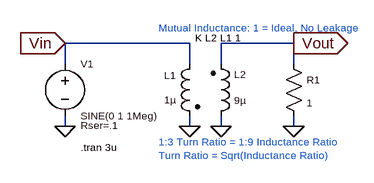
[diagram p0: schematic Transformer-2coil.asc]
Transformer-2coil.asc, the LTspice schematic file:
Version 4
SHEET 1 880 680
WIRE 256 96 64 96
WIRE 416 96 304 96
WIRE 64 128 64 96
WIRE 256 128 256 96
WIRE 304 128 304 96
WIRE 416 128 416 96
WIRE 64 224 64 208
WIRE 256 224 256 208
WIRE 304 224 304 208
WIRE 416 224 416 208
FLAG 64 224 0
FLAG 256 224 0
FLAG 304 224 0
FLAG 416 224 0
FLAG 416 96 Vout
IOPIN 416 96 Out
FLAG 64 96 Vin
IOPIN 64 96 In
SYMBOL voltage 64 112 R0
WINDOW 123 0 0 Left 0
WINDOW 39 24 110 Left 1
WINDOW 0 24 16 Left 1
WINDOW 3 24 96 Left 1
SYMATTR SpiceLine Rser=.1
SYMATTR InstName V1
SYMATTR Value SINE(0 1 1Meg)
SYMBOL res 400 112 R0
WINDOW 0 36 40 Left 1
WINDOW 3 36 76 Left 1
SYMATTR InstName R1
SYMATTR Value 1
SYMBOL ind2 272 112 M0
WINDOW 0 37 33 Left 1
WINDOW 3 37 71 Left 1
SYMATTR InstName L1
SYMATTR Value 1µ
SYMATTR Type ind
SYMBOL ind2 288 224 M180
WINDOW 0 36 80 Left 1
WINDOW 3 36 40 Left 1
SYMATTR InstName L2
SYMATTR Value 9µ
SYMATTR Type ind
TEXT 208 248 Left 1 ;1:3 Turn Ratio = 1:9 Inductance Ratio\nTurn Ratio = Sqrt(Inductance Ratio)
TEXT 264 88 Left 1 !K L2 L1 1
TEXT 208 72 Left 1 ;Mutual Inductance: 1 = Ideal, No Leakage
TEXT 88 256 Left 1 !.tran 3u

The netlist it stands for:
* Transformer-2coil.asc
V1 Vin 0 SINE(0 1 1Meg) Rser=.1
R1 Vout 0 1
L1 Vin 0 1µ
L2 0 Vout 9µ
* 1:3 Turn Ratio = 1:9 Inductance Ratio
* Turn Ratio = Sqrt(Inductance Ratio)
K L2 L1 1
* Mutual Inductance: 1 = Ideal, No Leakage
.tran 3u
.backanno
.end